# EAGLE schematic tides2_v40 (EAGLE 5.09)

## Sheet 1 of 5
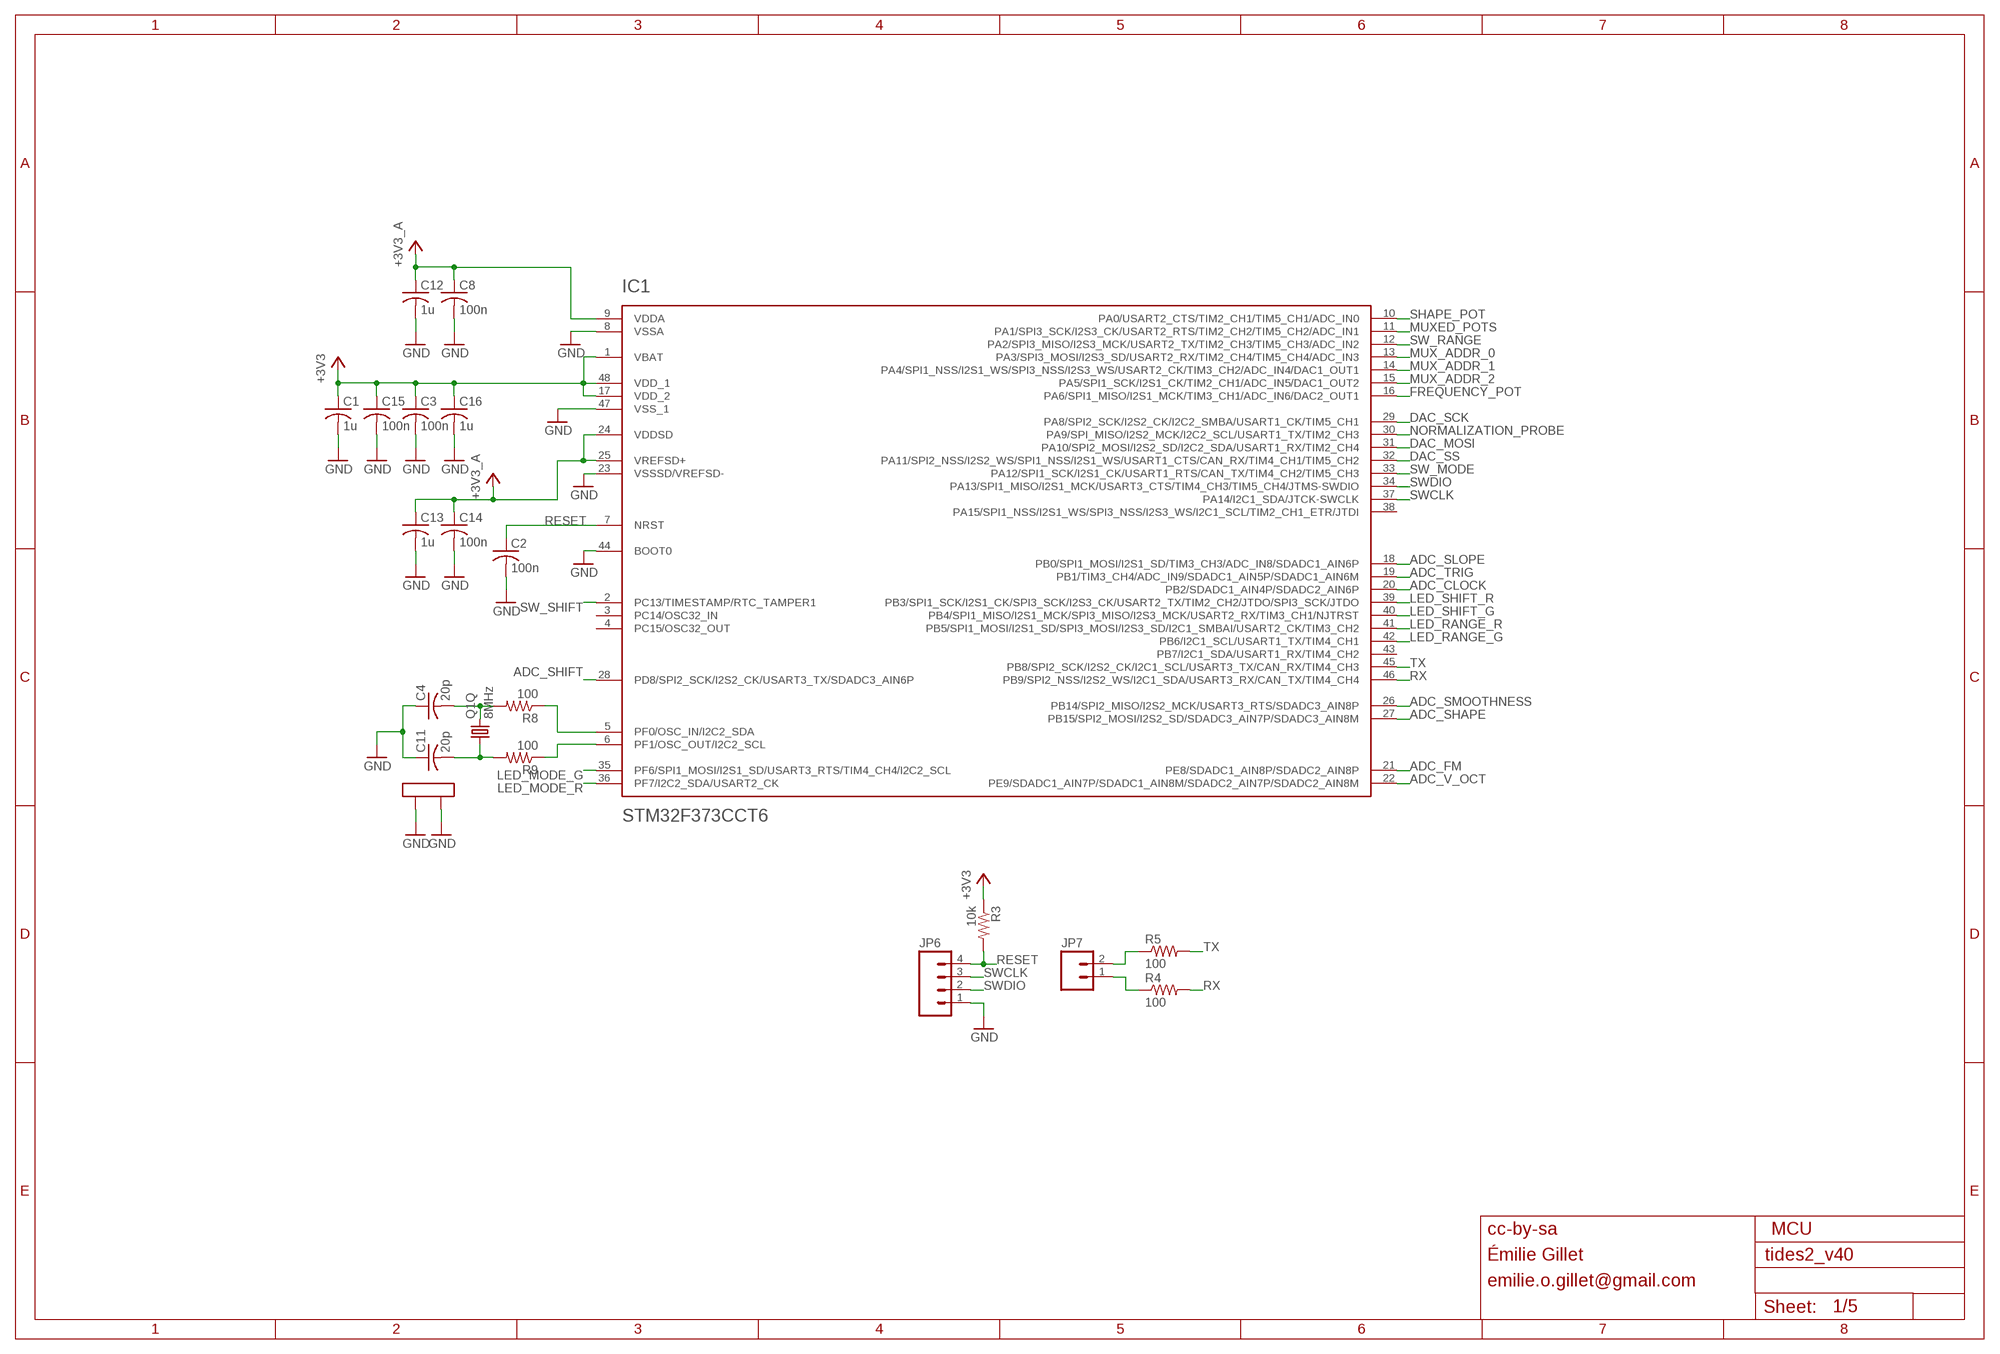
[diagram p0: schematic, sheet 1]

### Parts
C1  1u  C-USC0402  [C0402]
C2  100n  C-USC0402  [C0402]
C3  100n  C-USC0402  [C0402]
C4  20p  C-USC0402  [C0402]
C8  100n  C-USC0402  [C0402]
C11  20p  C-USC0402  [C0402]
C12  1u  C-USC0402  [C0402]
C13  1u  C-USC0402  [C0402]
C14  100n  C-USC0402  [C0402]
C15  100n  C-USC0402  [C0402]
C16  1u  C-USC0402  [C0402]
IC1  STM32F373CCT6  STM32F373C  [LQFP48]
JP6  M04PTH  [1X04]
JP7  M02PTH  [1X02]
Q1  8MHz  CRYSTAL  [CTS406]
R3  10k  R-US_R0402  [R0402]
R4  100  R-US_R0402  [R0402]
R5  100  R-US_R0402  [R0402]
R8  100  R-US_R0402  [R0402]
R9  100  R-US_R0402  [R0402]

### Nets
+3V3: C1.1 C3.1 C15.1 C16.1 IC1.1(VBAT) IC1.17(VDD_2) IC1.48(VDD_1) R3.1 ; also sheet 4,5
+3V3_A: C8.1 C12.1 C13.1 C14.1 IC1.9(VDDA) IC1.24(VDDSD) IC1.25(VREFSD+) ; also sheet 2,3,4,5
ADC_CLOCK: IC1.20(PB2/SDADC1_AIN4P/SDADC2_AIN6P) ; also sheet 3
ADC_FM: IC1.21(PE8/SDADC1_AIN8P/SDADC2_AIN8P) ; also sheet 3
ADC_SHAPE: IC1.27(PB15/SPI2_MOSI/I2S2_SD/SDADC3_AIN7P/SDADC3_AIN8M) ; also sheet 3
ADC_SHIFT: IC1.28(PD8/SPI2_SCK/I2S2_CK/USART3_TX/SDADC3_AIN6P) ; also sheet 3
ADC_SLOPE: IC1.18(PB0/SPI1_MOSI/I2S1_SD/TIM3_CH3/ADC_IN8/SDADC1_AIN6P) ; also sheet 3
ADC_SMOOTHNESS: IC1.26(PB14/SPI2_MISO/I2S2_MCK/USART3_RTS/SDADC3_AIN8P) ; also sheet 3
ADC_TRIG: IC1.19(PB1/TIM3_CH4/ADC_IN9/SDADC1_AIN5P/SDADC1_AIN6M) ; also sheet 3
ADC_V_OCT: IC1.22(PE9/SDADC1_AIN7P/SDADC1_AIN8M/SDADC2_AIN7P/SDADC2_AIN8M) ; also sheet 3
DAC_MOSI: IC1.31(PA10/SPI2_MOSI/I2S2_SD/I2C2_SDA/USART1_RX/TIM2_CH4) ; also sheet 4
DAC_SCK: IC1.29(PA8/SPI2_SCK/I2S2_CK/I2C2_SMBA/USART1_CK/TIM5_CH1) ; also sheet 4
DAC_SS: IC1.32(PA11/SPI2_NSS/I2S2_WS/SPI1_NSS/I2S1_WS/USART1_CTS/CAN_RX/TIM4_CH1/TIM5_CH2) ; also sheet 4
FREQUENCY_POT: IC1.16(PA6/SPI1_MISO/I2S1_MCK/TIM3_CH1/ADC_IN6/DAC2_OUT1) ; also sheet 2
GND: C1.2 C2.2 C3.2 C4.1 C8.2 C11.1 C12.2 C13.2 C14.2 C15.2 C16.2 IC1.8(VSSA) IC1.23(VSSSD/VREFSD-) IC1.44(BOOT0) IC1.47(VSS_1) JP6.1 Q1.2(LID1) Q1.4(LID2) ; also sheet 2,3,4,5
LED_MODE_G: IC1.35(PF6/SPI1_MOSI/I2S1_SD/USART3_RTS/TIM4_CH4/I2C2_SCL) ; also sheet 2
LED_MODE_R: IC1.36(PF7/I2C2_SDA/USART2_CK) ; also sheet 2
LED_RANGE_G: IC1.42(PB6/I2C1_SCL/USART1_TX/TIM4_CH1) ; also sheet 2
LED_RANGE_R: IC1.41(PB5/SPI1_MOSI/I2S1_SD/SPI3_MOSI/I2S3_SD/I2C1_SMBAI/USART2_CK/TIM3_CH2) ; also sheet 2
LED_SHIFT_G: IC1.40(PB4/SPI1_MISO/I2S1_MCK/SPI3_MISO/I2S3_MCK/USART2_RX/TIM3_CH1/NJTRST) ; also sheet 2
LED_SHIFT_R: IC1.39(PB3/SPI1_SCK/I2S1_CK/SPI3_SCK/I2S3_CK/USART2_TX/TIM2_CH2/JTDO/SPI3_SCK/JTDO) ; also sheet 2
MUX_ADDR_0: IC1.13(PA3/SPI3_MOSI/I2S3_SD/USART2_RX/TIM2_CH4/TIM5_CH4/ADC_IN3) ; also sheet 2
MUX_ADDR_1: IC1.14(PA4/SPI1_NSS/I2S1_WS/SPI3_NSS/I2S3_WS/USART2_CK/TIM3_CH2/ADC_IN4/DAC1_OUT1) ; also sheet 2
MUX_ADDR_2: IC1.15(PA5/SPI1_SCK/I2S1_CK/TIM2_CH1/ADC_IN5/DAC1_OUT2) ; also sheet 2
MUXED_POTS: IC1.11(PA1/SPI3_SCK/I2S3_CK/USART2_RTS/TIM2_CH2/TIM5_CH2/ADC_IN1) ; also sheet 2
N$7: IC1.5(PF0/OSC_IN/I2C2_SDA) R8.1
N$8: IC1.6(PF1/OSC_OUT/I2C2_SCL) R9.1
N$29: C4.2 Q1.3 R8.2
N$33: JP7.2 R5.1
N$35: C11.2 Q1.1 R9.2
N$51: JP7.1 R4.1
NORMALIZATION_PROBE: IC1.30(PA9/SPI_MISO/I2S2_MCK/I2C2_SCL/USART1_TX/TIM2_CH3) ; also sheet 3
RESET: C2.1 IC1.7(NRST) JP6.4 R3.2
RX: IC1.46(PB9/SPI2_NSS/I2S2_WS/I2C1_SDA/USART3_RX/CAN_TX/TIM4_CH4) R4.2
SHAPE_POT: IC1.10(PA0/USART2_CTS/TIM2_CH1/TIM5_CH1/ADC_IN0) ; also sheet 2
SW_MODE: IC1.33(PA12/SPI1_SCK/I2S1_CK/USART1_RTS/CAN_TX/TIM4_CH2/TIM5_CH3) ; also sheet 2
SW_RANGE: IC1.12(PA2/SPI3_MISO/I2S3_MCK/USART2_TX/TIM2_CH3/TIM5_CH3/ADC_IN2) ; also sheet 2
SW_SHIFT: IC1.2(PC13/TIMESTAMP/RTC_TAMPER1) ; also sheet 2
SWCLK: IC1.37(PA14/I2C1_SDA/JTCK-SWCLK) JP6.3
SWDIO: IC1.34(PA13/SPI1_MISO/I2S1_MCK/USART3_CTS/TIM4_CH3/TIM5_CH4/JTMS-SWDIO) JP6.2
TX: IC1.45(PB8/SPI2_SCK/I2S2_CK/I2C1_SCL/USART3_TX/CAN_RX/TIM4_CH3) R5.2
Unconnected: IC1.3(PC14/OSC32_IN) IC1.4(PC15/OSC32_OUT) IC1.38(PA15/SPI1_NSS/I2S1_WS/SPI3_NSS/I2S3_WS/I2C1_SCL/TIM2_CH1_ETR/JTDI) IC1.43(PB7/I2C1_SDA/USART1_RX/TIM4_CH2)

### Notes on the sheet
- cc-by-sa | MCU
- Émilie Gillet
- emilie.o.gillet@gmail.com

## Sheet 2 of 5
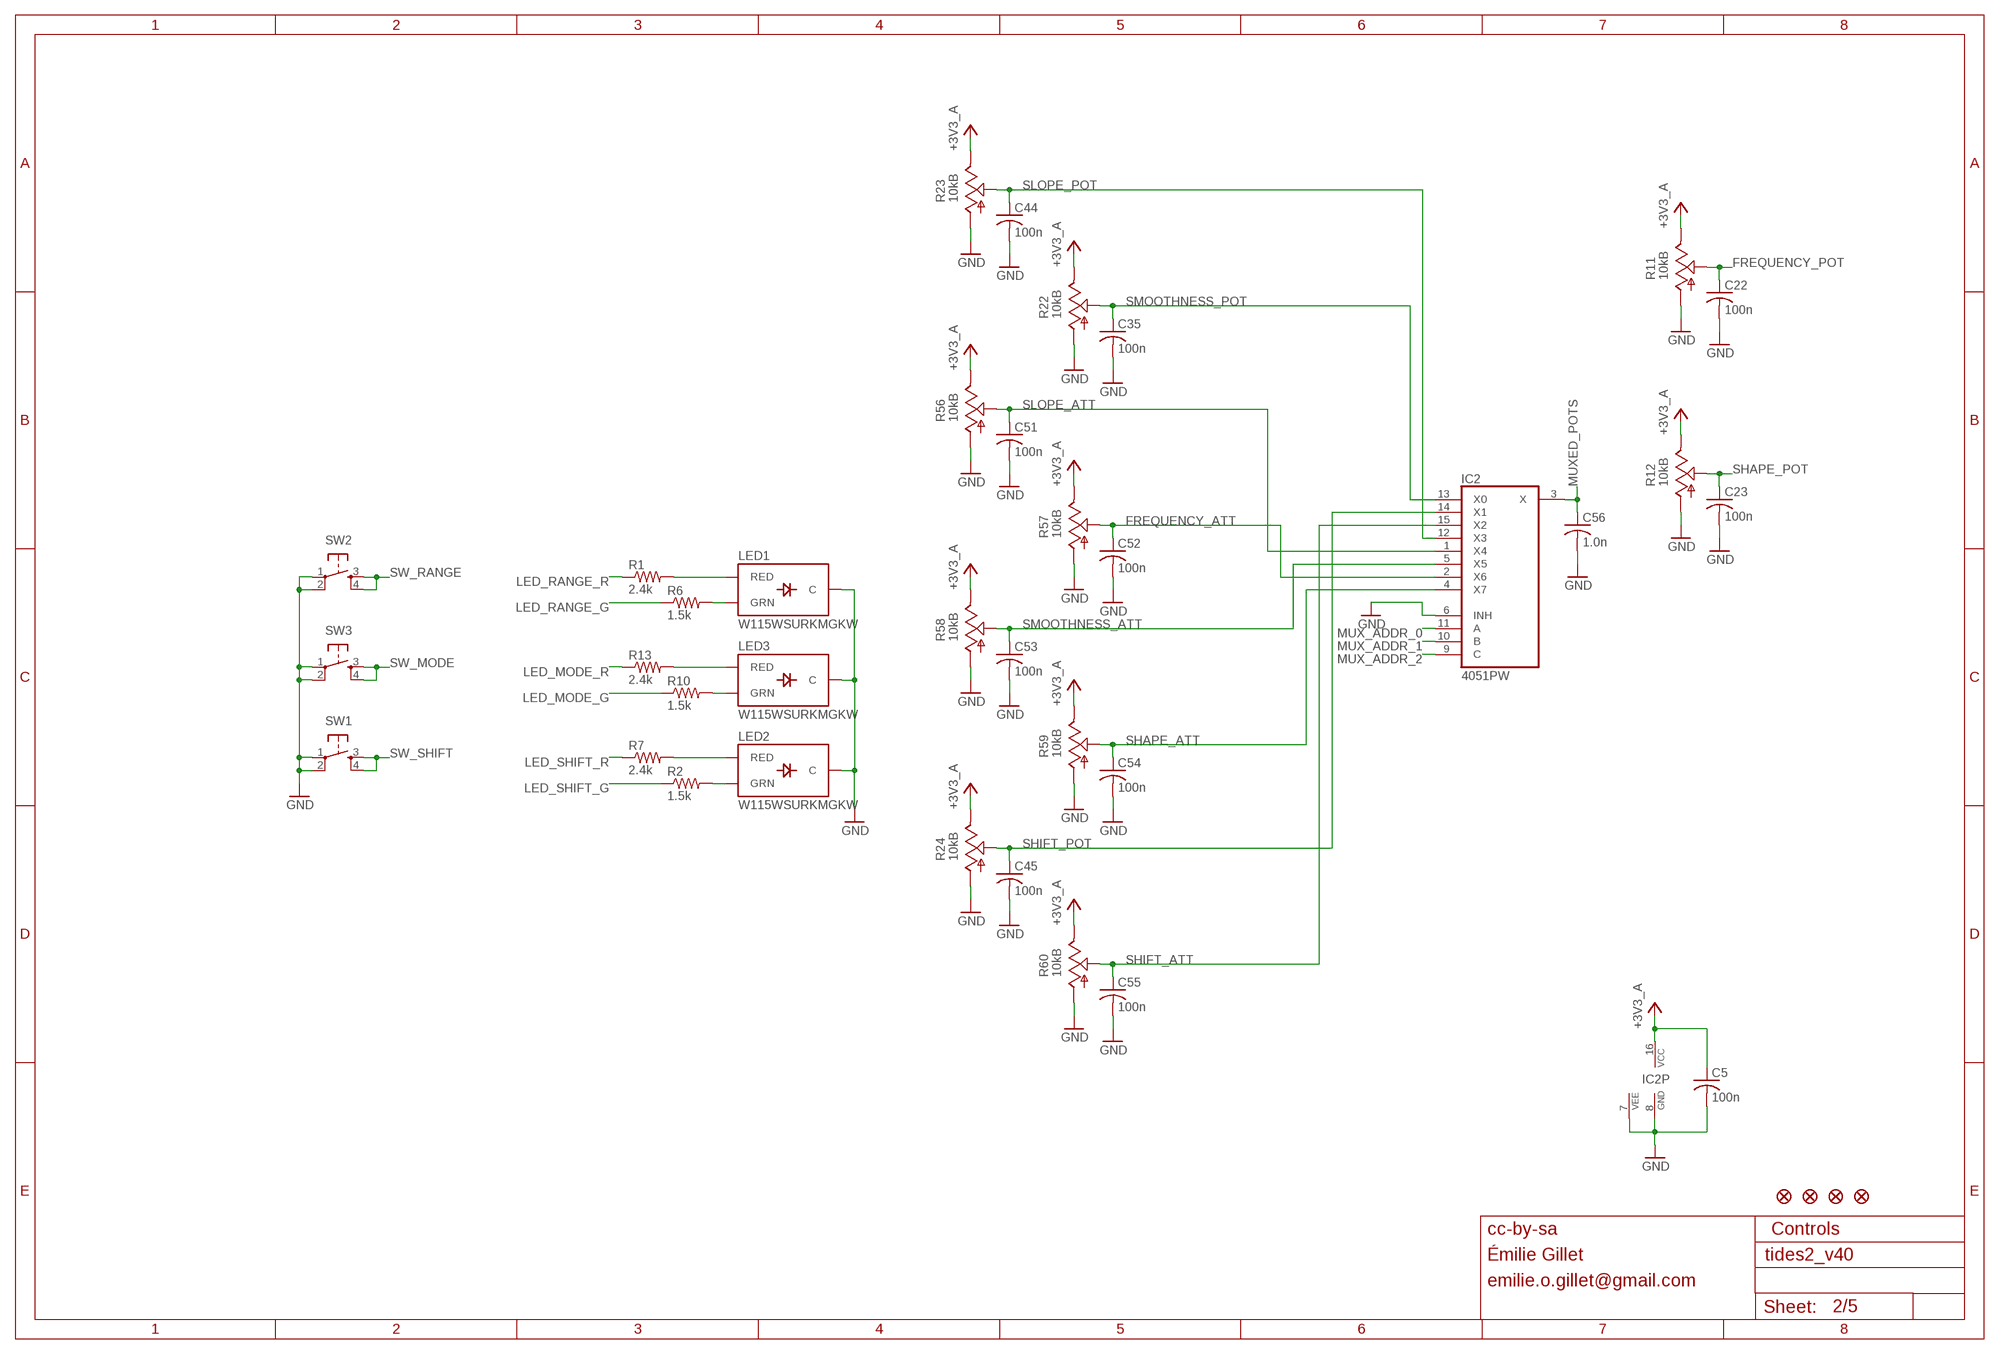
[diagram p1: schematic, sheet 2]

### Parts
C5  100n  C-USC0402  [C0402]
C22  100n  C-USC0402  [C0402]
C23  100n  C-USC0402  [C0402]
C35  100n  C-USC0402  [C0402]
C44  100n  C-USC0402  [C0402]
C45  100n  C-USC0402  [C0402]
C51  100n  C-USC0402  [C0402]
C52  100n  C-USC0402  [C0402]
C53  100n  C-USC0402  [C0402]
C54  100n  C-USC0402  [C0402]
C55  100n  C-USC0402  [C0402]
C56  1.0n  C-USC0402  [C0402]
IC2  4051PW  [TSSOP16_065]
JP1  FIDUCIAL1X2  [FIDUCIAL-1X2]
JP2  FIDUCIAL1X2  [FIDUCIAL-1X2]
JP3  FIDUCIAL1X2  [FIDUCIAL-1X2]
JP4  FIDUCIAL1X2  [FIDUCIAL-1X2]
LED1  W115WSURKMGKW  LED-BICOLOR-THROUGHHOLE2.54  [LED-BICOLOR-THROUGHHOLE-2.54]
LED2  W115WSURKMGKW  LED-BICOLOR-THROUGHHOLE2.54  [LED-BICOLOR-THROUGHHOLE-2.54]
LED3  W115WSURKMGKW  LED-BICOLOR-THROUGHHOLE2.54  [LED-BICOLOR-THROUGHHOLE-2.54]
R1  2.4k  R-US_R0402  [R0402]
R2  1.5k  R-US_R0402  [R0402]
R6  1.5k  R-US_R0402  [R0402]
R7  2.4k  R-US_R0402  [R0402]
R10  1.5k  R-US_R0402  [R0402]
R11  10kB  POT_USVERTICAL_PS  [ALPS_POT_VERTICAL_PS]
R12  10kB  POT_USVERTICAL_PS  [ALPS_POT_VERTICAL_PS]
R13  2.4k  R-US_R0402  [R0402]
R22  10kB  POT_USVERTICAL_PS  [ALPS_POT_VERTICAL_PS]
R23  10kB  POT_USVERTICAL_PS  [ALPS_POT_VERTICAL_PS]
R24  10kB  POT_USVERTICAL_PS  [ALPS_POT_VERTICAL_PS]
R56  10kB  POT_USVERTICAL  [ALPS_POT_VERTICAL]
R57  10kB  POT_USVERTICAL  [ALPS_POT_VERTICAL]
R58  10kB  POT_USVERTICAL  [ALPS_POT_VERTICAL]
R59  10kB  POT_USVERTICAL  [ALPS_POT_VERTICAL]
R60  10kB  POT_USVERTICAL  [ALPS_POT_VERTICAL]
SW1  TAC_SWITCHPTH  [TACTILE-PTH]
SW2  TAC_SWITCHPTH  [TACTILE-PTH]
SW3  TAC_SWITCHPTH  [TACTILE-PTH]

### Nets
+3V3_A: C5.1 IC2.16(VCC) R11.P$1(E) R12.P$1(E) R22.P$1(E) R23.P$1(E) R24.P$1(E) R56.P$1(E) R57.P$1(E) R58.P$1(E) R59.P$1(E) R60.P$1(E) ; also sheet 1,3,4,5
FREQUENCY_ATT: C52.1 IC2.2(X6) R57.P$2(S)
FREQUENCY_POT: C22.1 R11.P$2(S) ; also sheet 1
GND: C5.2 C22.2 C23.2 C35.2 C44.2 C45.2 C51.2 C52.2 C53.2 C54.2 C55.2 C56.2 IC2.6(INH) IC2.7(VEE) IC2.8(GND) LED1.2(C) LED2.2(C) LED3.2(C) R11.P$3(A) R12.P$3(A) R22.P$3(A) R23.P$3(A) R24.P$3(A) R56.P$3(A) R57.P$3(A) R58.P$3(A) R59.P$3(A) R60.P$3(A) SW1.1 SW1.2 SW2.1 SW2.2 SW3.1 SW3.2 ; also sheet 1,3,4,5
LED_MODE_G: R10.1 ; also sheet 1
LED_MODE_R: R13.1 ; also sheet 1
LED_RANGE_G: R6.1 ; also sheet 1
LED_RANGE_R: R1.1 ; also sheet 1
LED_SHIFT_G: R2.1 ; also sheet 1
LED_SHIFT_R: R7.1 ; also sheet 1
MUX_ADDR_0: IC2.11(A) ; also sheet 1
MUX_ADDR_1: IC2.10(B) ; also sheet 1
MUX_ADDR_2: IC2.9(C) ; also sheet 1
MUXED_POTS: C56.1 IC2.3(X) ; also sheet 1
N$16: LED1.3(RED) R1.2
N$18: LED3.3(RED) R13.2
N$20: LED3.1(GRN) R10.2
N$21: LED2.3(RED) R7.2
N$22: LED1.1(GRN) R6.2
N$23: LED2.1(GRN) R2.2
SHAPE_ATT: C54.1 IC2.4(X7) R59.P$2(S)
SHAPE_POT: C23.1 R12.P$2(S) ; also sheet 1
SHIFT_ATT: C55.1 IC2.15(X2) R60.P$2(S)
SHIFT_POT: C45.1 IC2.14(X1) R24.P$2(S)
SLOPE_ATT: C51.1 IC2.1(X4) R56.P$2(S)
SLOPE_POT: C44.1 IC2.12(X3) R23.P$2(S)
SMOOTHNESS_ATT: C53.1 IC2.5(X5) R58.P$2(S)
SMOOTHNESS_POT: C35.1 IC2.13(X0) R22.P$2(S)
SW_MODE: SW3.3 SW3.4 ; also sheet 1
SW_RANGE: SW2.3 SW2.4 ; also sheet 1
SW_SHIFT: SW1.3 SW1.4 ; also sheet 1

### Notes on the sheet
- cc-by-sa | Controls
- Émilie Gillet
- emilie.o.gillet@gmail.com

## Sheet 3 of 5
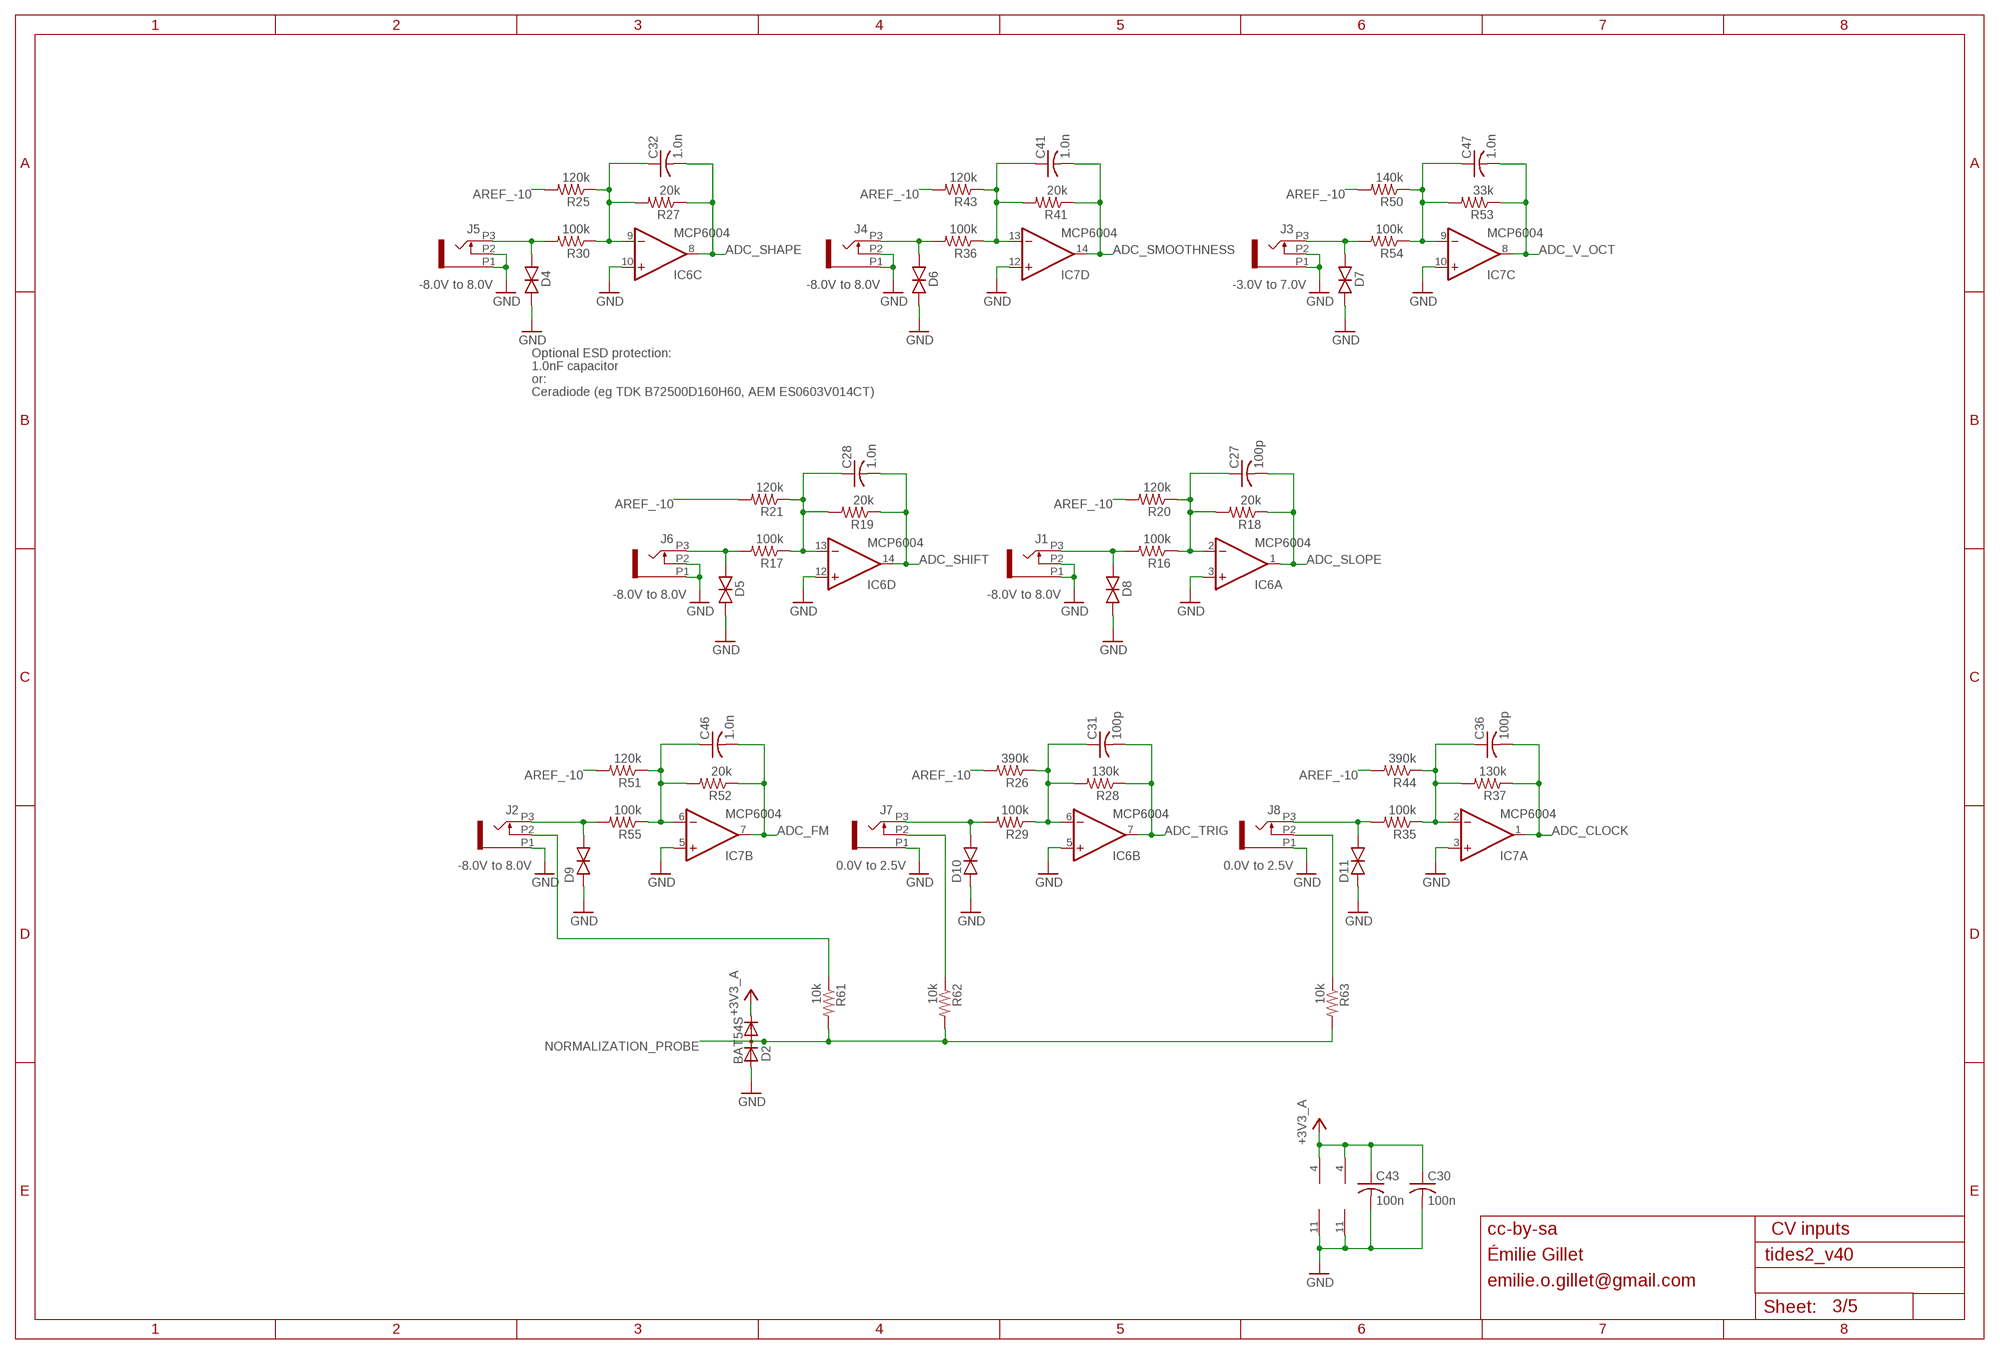
[diagram p2: schematic, sheet 3]

### Parts
C27  100p  C-USC0402  [C0402]
C28  1.0n  C-USC0402  [C0402]
C30  100n  C-USC0402  [C0402]
C31  100p  C-USC0402  [C0402]
C32  1.0n  C-USC0402  [C0402]
C36  100p  C-USC0402  [C0402]
C41  1.0n  C-USC0402  [C0402]
C43  100n  C-USC0402  [C0402]
C46  1.0n  C-USC0402  [C0402]
C47  1.0n  C-USC0402  [C0402]
D2  BAT54S  DIODE_2CACA-SOT23  [SOT23]
D4  TVS  [0603]
D5  TVS  [0603]
D6  TVS  [0603]
D7  TVS  [0603]
D8  TVS  [0603]
D9  TVS  [0603]
D10  TVS  [0603]
D11  TVS  [0603]
IC6  MCP6004  TL074PW  [TSSOP14_065]
IC7  MCP6004  TL074PW  [TSSOP14_065]
J1  PJ301_THONKICONN6  [WQP_PJ_301M6]
J2  PJ301_THONKICONN6  [WQP_PJ_301M6]
J3  PJ301_THONKICONN6  [WQP_PJ_301M6]
J4  PJ301_THONKICONN6  [WQP_PJ_301M6]
J5  PJ301_THONKICONN6  [WQP_PJ_301M6]
J6  PJ301_THONKICONN6  [WQP_PJ_301M6]
J7  PJ301_THONKICONN6  [WQP_PJ_301M6]
J8  PJ301_THONKICONN6  [WQP_PJ_301M6]
R16  100k  R-US_R0402  [R0402]
R17  100k  R-US_R0402  [R0402]
R18  20k  R-US_R0402  [R0402]
R19  20k  R-US_R0402  [R0402]
R20  120k  R-US_R0402  [R0402]
R21  120k  R-US_R0402  [R0402]
R25  120k  R-US_R0402  [R0402]
R26  390k  R-US_R0402  [R0402]
R27  20k  R-US_R0402  [R0402]
R28  130k  R-US_R0402  [R0402]
R29  100k  R-US_R0402  [R0402]
R30  100k  R-US_R0402  [R0402]
R35  100k  R-US_R0402  [R0402]
R36  100k  R-US_R0402  [R0402]
R37  130k  R-US_R0402  [R0402]
R41  20k  R-US_R0402  [R0402]
R43  120k  R-US_R0402  [R0402]
R44  390k  R-US_R0402  [R0402]
R50  140k  R-US_R0402  [R0402]
R51  120k  R-US_R0402  [R0402]
R52  20k  R-US_R0402  [R0402]
R53  33k  R-US_R0402  [R0402]
R54  100k  R-US_R0402  [R0402]
R55  100k  R-US_R0402  [R0402]
R61  10k  R-US_R0402  [R0402]
R62  10k  R-US_R0402  [R0402]
R63  10k  R-US_R0402  [R0402]

### Nets
+3V3_A: C30.1 C43.1 D2.2(C) IC6.4(P:V+) IC7.4(P:V+) ; also sheet 1,2,4,5
ADC_CLOCK: C36.2 IC7.1(A:OUT) R37.1 ; also sheet 1
ADC_FM: C46.2 IC7.7(B:OUT) R52.1 ; also sheet 1
ADC_SHAPE: C32.2 IC6.8(C:OUT) R27.1 ; also sheet 1
ADC_SHIFT: C28.2 IC6.14(D:OUT) R19.1 ; also sheet 1
ADC_SLOPE: C27.2 IC6.1(A:OUT) R18.1 ; also sheet 1
ADC_SMOOTHNESS: C41.2 IC7.14(D:OUT) R41.1 ; also sheet 1
ADC_TRIG: C31.2 IC6.7(B:OUT) R28.1 ; also sheet 1
ADC_V_OCT: C47.2 IC7.8(C:OUT) R53.1 ; also sheet 1
AREF_-10: R20.2 R21.2 R25.2 R26.2 R43.2 R44.2 R50.2 R51.2 ; also sheet 5
CLOCK_IN: D11.2(C) J8.P3 R35.2
FM_IN: D9.2(C) J2.P3 R55.2
GND: C30.2 C43.2 D2.1(A) D4.1(A) D5.1(A) D6.1(A) D7.1(A) D8.1(A) D9.1(A) D10.1(A) D11.1(A) IC6.3(A:+IN) IC6.5(B:+IN) IC6.10(C:+IN) IC6.11(P:V-) IC6.12(D:+IN) IC7.3(A:+IN) IC7.5(B:+IN) IC7.10(C:+IN) IC7.11(P:V-) IC7.12(D:+IN) J1.P1 J1.P2 J2.P1 J3.P1 J3.P2 J4.P1 J4.P2 J5.P1 J5.P2 J6.P1 J6.P2 J7.P1 J8.P1 ; also sheet 1,2,4,5
N$2: J7.P2 R62.1
N$3: J8.P2 R63.1
N$4: C27.1 IC6.2(A:-IN) R16.1 R18.2 R20.1
N$26: J2.P2 R61.1
N$28: C28.1 IC6.13(D:-IN) R17.1 R19.2 R21.1
N$30: C47.1 IC7.9(C:-IN) R50.1 R53.2 R54.1
N$32: C46.1 IC7.6(B:-IN) R51.1 R52.2 R55.1
N$34: C31.1 IC6.6(B:-IN) R26.1 R28.2 R29.1
N$37: C32.1 IC6.9(C:-IN) R25.1 R27.2 R30.1
N$39: C36.1 IC7.2(A:-IN) R35.1 R37.2 R44.1
N$41: C41.1 IC7.13(D:-IN) R36.1 R41.2 R43.1
NORMALIZATION_PROBE: D2.3(AC) R61.2 R62.2 R63.2 ; also sheet 1
SHAPE_IN: D4.2(C) J5.P3 R30.2
SHIFT_IN: D5.2(C) J6.P3 R17.2
SLOPE_IN: D8.2(C) J1.P3 R16.2
SMOOTHNESS_IN: D6.2(C) J4.P3 R36.2
TRIG_IN: D10.2(C) J7.P3 R29.2
V_OCT_IN: D7.2(C) J3.P3 R54.2

### Notes on the sheet
- -8.0V to 8.0V | -8.0V to 8.0V | -3.0V to 7.0V
- Optional ESD protection:
- 1.0nF capacitor
- or:
- Ceradiode (eg TDK B72500D160H60, AEM ES0603V014CT)
- -8.0V to 8.0V | -8.0V to 8.0V
- -8.0V to 8.0V | 0.0V to 2.5V | 0.0V to 2.5V
- cc-by-sa | CV inputs
- Émilie Gillet
- emilie.o.gillet@gmail.com

## Sheet 4 of 5
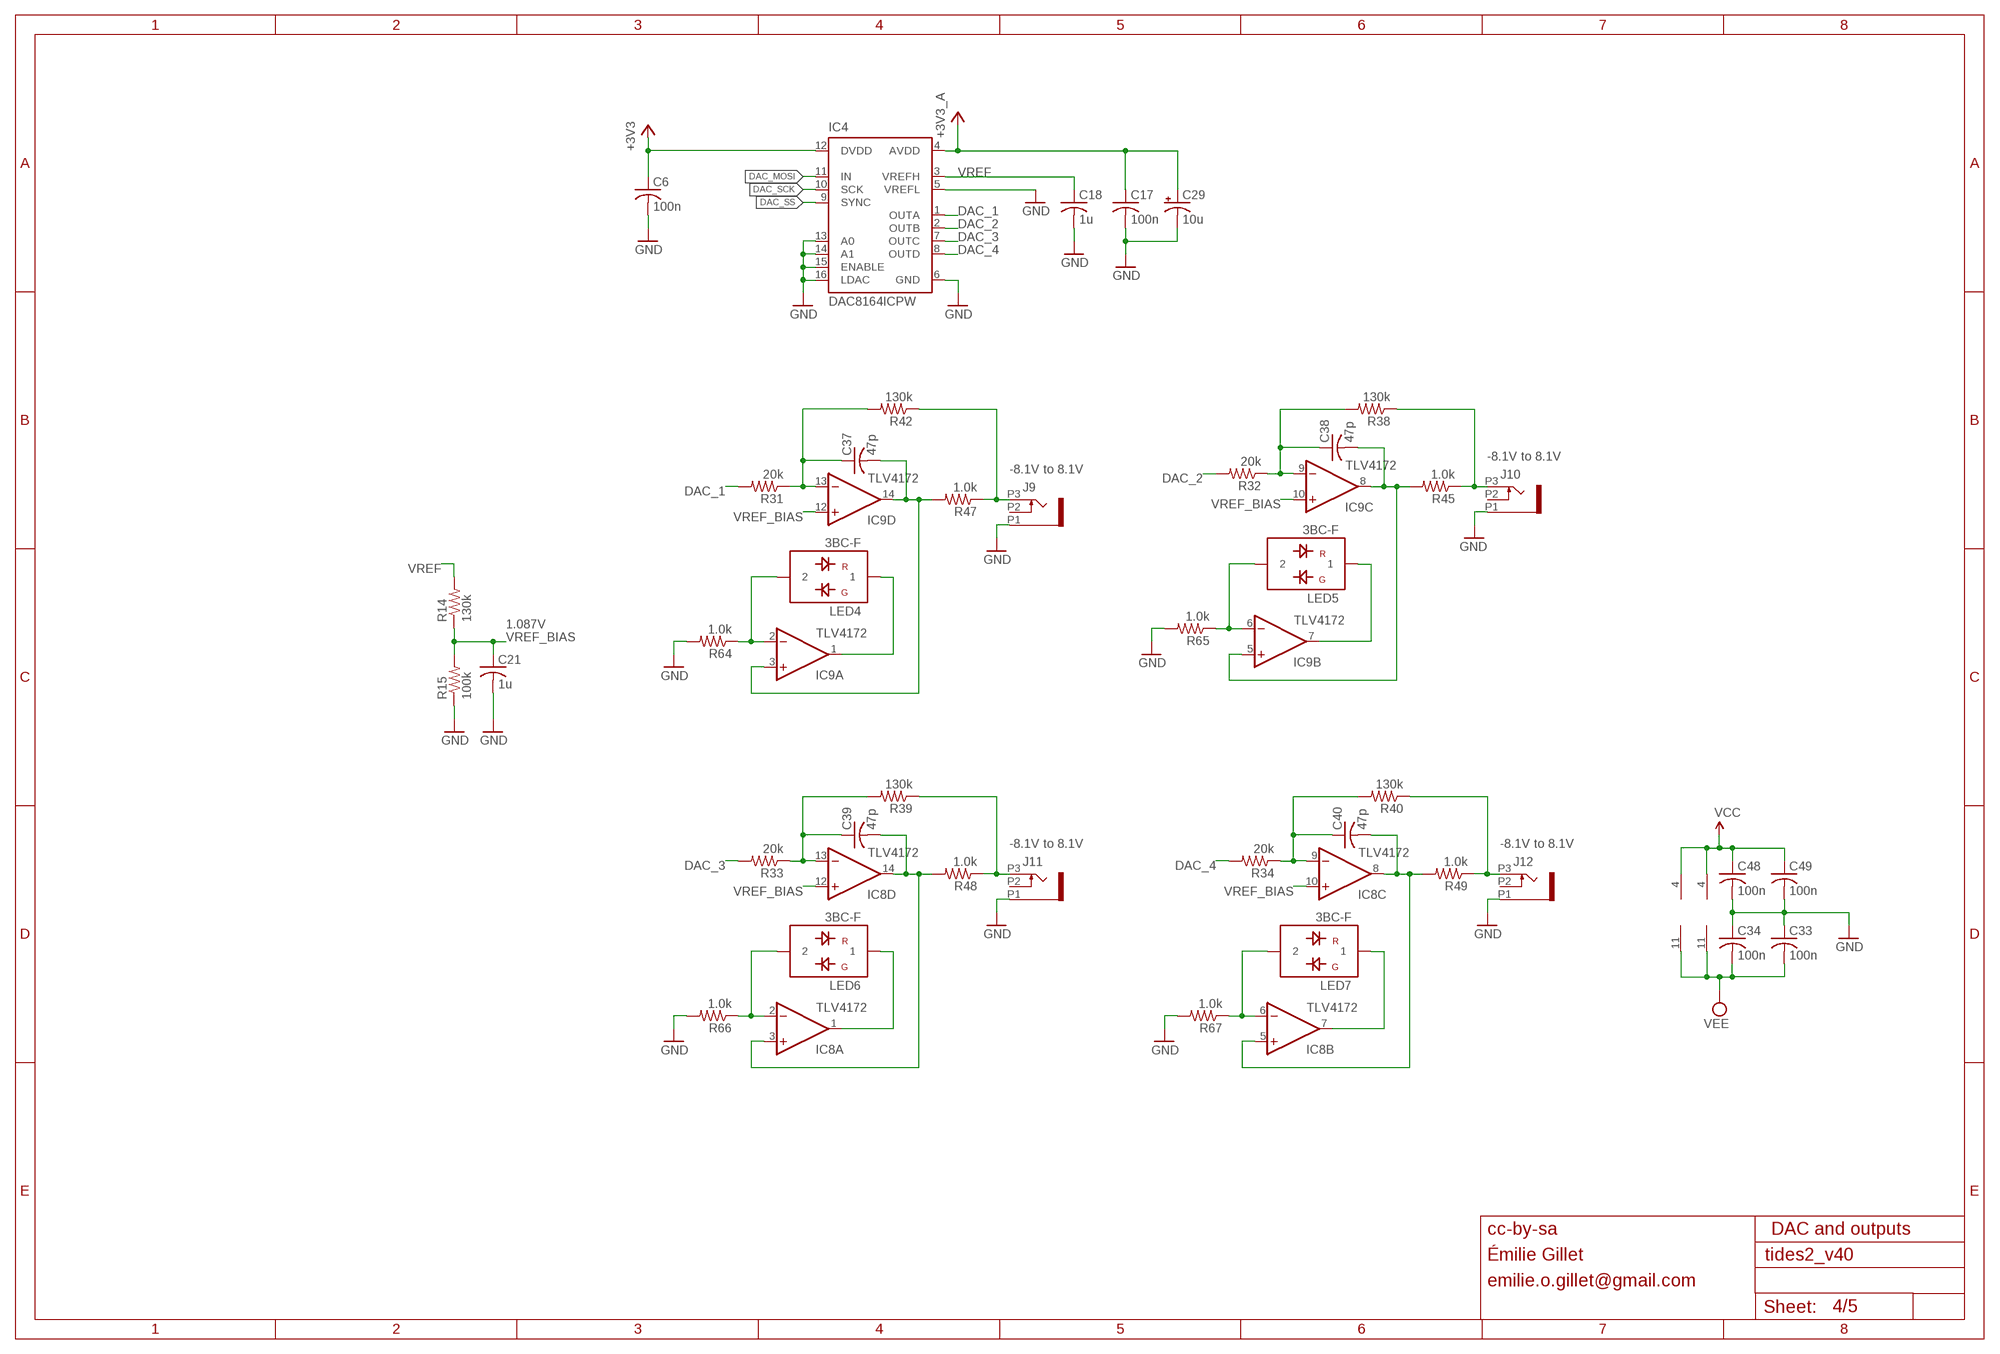
[diagram p3: schematic, sheet 4]

### Parts
C6  100n  C-USC0402  [C0402]
C17  100n  C-USC0402  [C0402]
C18  1u  C-USC0402  [C0402]
C21  1u  C-USC0402  [C0402]
C29  10u  CPOL-USA  [PANASONIC_A]
C33  100n  C-USC0402  [C0402]
C34  100n  C-USC0402  [C0402]
C37  47p  C-USC0402  [C0402]
C38  47p  C-USC0402  [C0402]
C39  47p  C-USC0402  [C0402]
C40  47p  C-USC0402  [C0402]
C48  100n  C-USC0402  [C0402]
C49  100n  C-USC0402  [C0402]
IC4  DAC8164ICPW  DAC8564  [SOP65P640X110-16N]
IC8  TLV4172  TL074PW  [TSSOP14_065]
IC9  TLV4172  TL074PW  [TSSOP14_065]
J9  PJ301_THONKICONN6  [WQP_PJ_301M6]
J10  PJ301_THONKICONN6  [WQP_PJ_301M6]
J11  PJ301_THONKICONN6  [WQP_PJ_301M6]
J12  PJ301_THONKICONN6  [WQP_PJ_301M6]
LED4  3BC-F  LED-BICOLOR-SHARED-THROUGHHOLE  [LED3MM]
LED5  3BC-F  LED-BICOLOR-SHARED-THROUGHHOLE  [LED3MM]
LED6  3BC-F  LED-BICOLOR-SHARED-THROUGHHOLE  [LED3MM]
LED7  3BC-F  LED-BICOLOR-SHARED-THROUGHHOLE  [LED3MM]
R14  130k  R-US_R0402  [R0402]
R15  100k  R-US_R0402  [R0402]
R31  20k  R-US_R0402  [R0402]
R32  20k  R-US_R0402  [R0402]
R33  20k  R-US_R0402  [R0402]
R34  20k  R-US_R0402  [R0402]
R38  130k  R-US_R0402  [R0402]
R39  130k  R-US_R0402  [R0402]
R40  130k  R-US_R0402  [R0402]
R42  130k  R-US_R0402  [R0402]
R45  1.0k  R-US_R0603  [R0603]
R47  1.0k  R-US_R0603  [R0603]
R48  1.0k  R-US_R0603  [R0603]
R49  1.0k  R-US_R0603  [R0603]
R64  1.0k  R-US_R0402  [R0402]
R65  1.0k  R-US_R0402  [R0402]
R66  1.0k  R-US_R0402  [R0402]
R67  1.0k  R-US_R0402  [R0402]

### Nets
+3V3: C6.1 IC4.12(DVDD) ; also sheet 1,5
+3V3_A: C17.1 C29.+ IC4.4(AVDD) ; also sheet 1,2,3,5
DAC_1: IC4.1(OUTA) R31.2
DAC_2: IC4.2(OUTB) R32.2
DAC_3: IC4.7(OUTC) R33.2
DAC_4: IC4.8(OUTD) R34.2
DAC_MOSI: IC4.11(IN) ; also sheet 1
DAC_SCK: IC4.10(SCK) ; also sheet 1
DAC_SS: IC4.9(SYNC) ; also sheet 1
GND: C6.2 C17.2 C18.2 C21.2 C29.- C33.1 C34.1 C48.2 C49.2 IC4.5(VREFL) IC4.6(GND) IC4.13(A0) IC4.14(A1) IC4.15(ENABLE) IC4.16(LDAC) J9.P1 J10.P1 J11.P1 J12.P1 R15.1 R64.2 R65.2 R66.2 R67.2 ; also sheet 1,2,3,5
N$45: C37.2 IC9.3(A:+IN) IC9.14(D:OUT) R47.2
N$49: J11.P3 R39.1 R48.1
N$53: J9.P3 R42.1 R47.1
N$54: C39.1 IC8.13(D:-IN) R33.1 R39.2
N$58: J12.P3 R40.1 R49.1
N$59: C40.1 IC8.9(C:-IN) R34.1 R40.2
N$60: C38.1 IC9.9(C:-IN) R32.1 R38.2
N$61: C37.1 IC9.13(D:-IN) R31.1 R42.2
N$63: J10.P3 R38.1 R45.1
N$67: IC9.2(A:-IN) LED4.2 R64.1
N$68: IC9.1(A:OUT) LED4.1
N$70: C38.2 IC9.5(B:+IN) IC9.8(C:OUT) R45.2
N$71: IC9.6(B:-IN) LED5.2 R65.1
N$72: IC9.7(B:OUT) LED5.1
N$73: C39.2 IC8.3(A:+IN) IC8.14(D:OUT) R48.2
N$74: IC8.2(A:-IN) LED6.2 R66.1
N$75: IC8.1(A:OUT) LED6.1
N$76: C40.2 IC8.5(B:+IN) IC8.8(C:OUT) R49.2
N$77: IC8.6(B:-IN) LED7.2 R67.1
N$78: IC8.7(B:OUT) LED7.1
VCC: C48.1 C49.1 IC8.4(P:V+) IC9.4(P:V+) ; also sheet 5
VEE: C33.2 C34.2 IC8.11(P:V-) IC9.11(P:V-) ; also sheet 5
VREF: C18.1 IC4.3(VREFH) R14.2
VREF_BIAS: C21.1 IC8.10(C:+IN) IC8.12(D:+IN) IC9.10(C:+IN) IC9.12(D:+IN) R14.1 R15.2
Unconnected: J9.P2 J10.P2 J11.P2 J12.P2

### Notes on the sheet
- -8.1V to 8.1V
- -8.1V to 8.1V
- 1.087V
- -8.1V to 8.1V | -8.1V to 8.1V
- cc-by-sa | DAC and outputs
- Émilie Gillet
- emilie.o.gillet@gmail.com

## Sheet 5 of 5
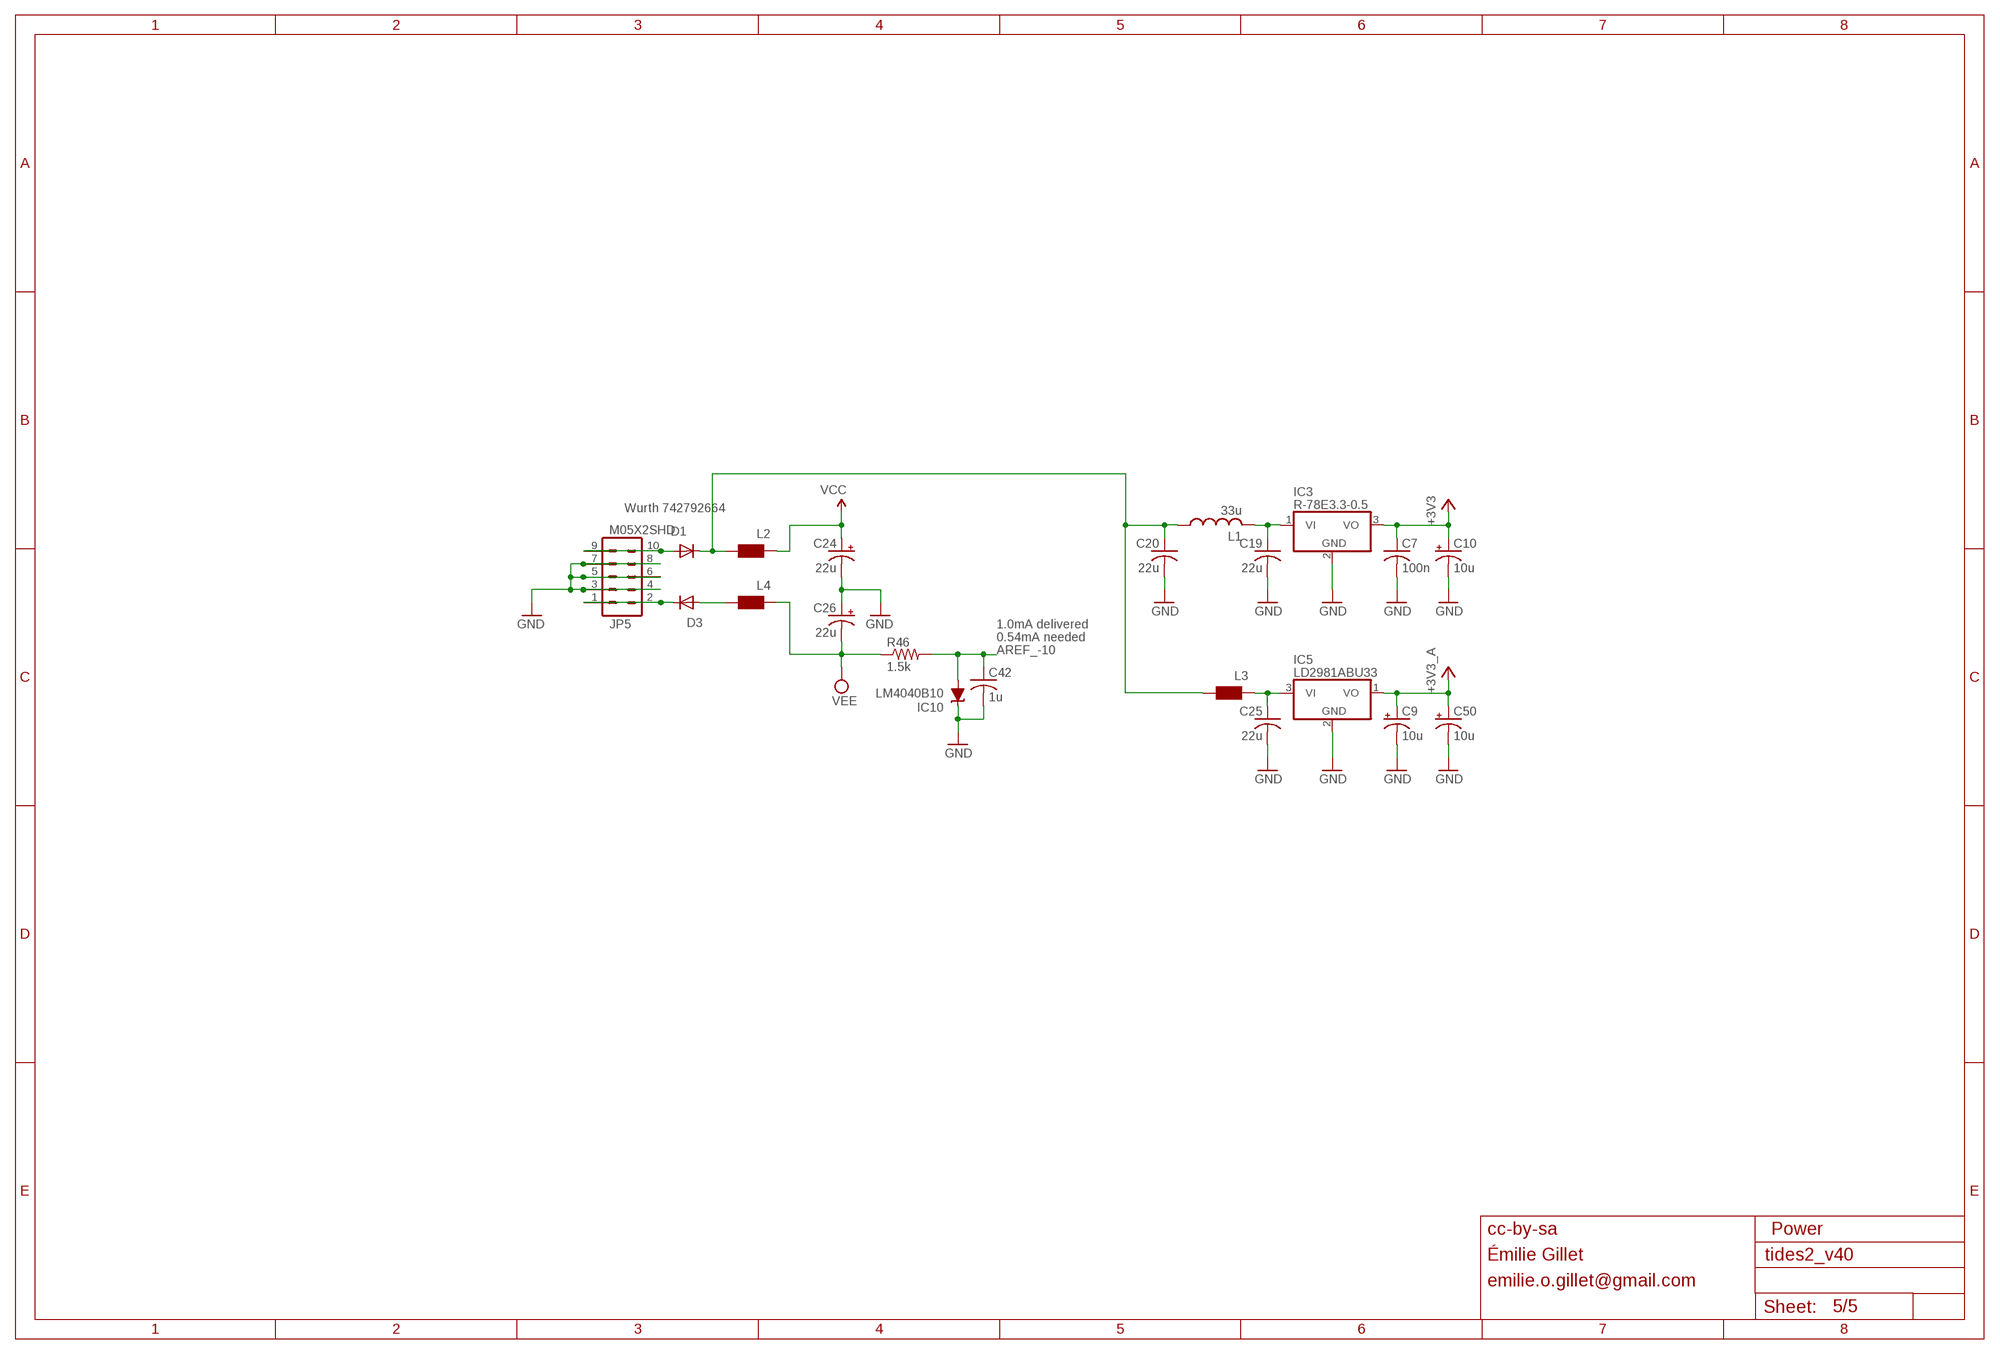
[diagram p4: schematic, sheet 5]

### Parts
C7  100n  C-USC0402  [C0402]
C9  10u  CPOL-USA  [PANASONIC_A]
C10  10u  CPOL-USA  [PANASONIC_A]
C19  22u  C-USC1206  [C1206]
C20  22u  C-USC1206  [C1206]
C24  22u  CPOL-USB  [PANASONIC_B]
C25  22u  C-USC1206  [C1206]
C26  22u  CPOL-USB  [PANASONIC_B]
C42  1u  C-USC0402  [C0402]
C50  10u  CPOL-USA  [PANASONIC_A]
D1  1N5819HW  DIODE-SOD123  [SOD123]
D3  1N5819HW  DIODE-SOD123  [SOD123]
IC3  R-78E3.3-0.5  WE173950378  [WE78]
IC5  LD2981ABU33  LD2981ABU  [SOT89]
IC10  LM4040B10  LM4041B12DBZ  [DBZ_R-PDSO-G3]
JP5  M05X2SHD  [2X5-SHROUDED]
L1  33u  L-USL2012C  [L2012C]
L2  WE-CBF_0603  [0603]
L3  WE-CBF_0603  [0603]
L4  WE-CBF_0603  [0603]
R46  1.5k  R-US_R0402  [R0402]

### Nets
+3V3: C7.1 C10.+ IC3.3(VO) ; also sheet 1,4
+3V3_A: C9.+ C50.+ IC5.1(VO) ; also sheet 1,2,3,4
AREF_-10: C42.1 IC10.2(A) R46.2 ; also sheet 3
GND: C7.2 C9.- C10.- C19.2 C20.2 C24.- C25.2 C26.+ C42.2 C50.- IC3.2(GND) IC5.2(GND) IC10.1(C) JP5.3 JP5.4 JP5.5 JP5.6 JP5.7 JP5.8 ; also sheet 1,2,3,4
N$1: C19.1 IC3.1(VI) L1.2
N$38: D3.A L4.2
N$40: C20.1 D1.C L1.1 L2.2 L3.2
N$42: C25.1 IC5.3(VI) L3.1
N$56: D1.A JP5.9 JP5.10
N$64: D3.C JP5.1 JP5.2
VCC: C24.+ L2.1 ; also sheet 4
VEE: C26.- L4.1 R46.1 ; also sheet 4

### Notes on the sheet
- Wurth 742792664
- 1.0mA delivered
- 0.54mA needed
- cc-by-sa | Power
- Émilie Gillet
- emilie.o.gillet@gmail.com

## Library data of the parts
C1-C8 C11-C23 C25 C27 C28 C30-C49 C51-C56 = rcl:C-US: CAPACITOR, American symbol
C9 C10 C24 C26 C29 C50 = rcl:CPOL-US: POLARIZED CAPACITOR, American symbol
D1 D3 = diode:DIODE-: DIODE
D2 = diode:DIODE_2CACA-: 2 Diodes - Cathode-Anode|Cathode-Anode
D4-D11 = og-diodes:TVS
IC1 = og-stm32f2:STM32F373C
IC2 = og-ics:4051: 8-channel ANALOG MULTIPLEXER
IC3 = og-vreg:WE173950378
IC4 = og-dac:DAC8564
IC5 = og-vreg:LD2981
IC6-IC9 = og-linear:TL074: OP AMP
IC10 = texas:LM4041: PRECISION MICROPOWER SHUNT VOLTAGE REFERENCE Source: http://focus.ti.com/lit/ds/slcs146e/slcs146e.pdf
J1-J8 = og-pj301_variations:PJ301_THONKICONN
J9-J12 = og-pj301:PJ301_THONKICONN
JP1-JP4 = SparkFun:FIDUCIAL: Fiducial Alignment Points Various fiducial points for machine vision alignment.
JP5 = og-header:M05X2: Header 5x2 Standard 10-pin dual row 0.1" header. Commonly used with AVR-ISP. Use with Spark Fun Electronics SKU: PRT-00778
JP6 = SparkFun:M04: Header 4 Standard 4-pin 0.1" header. Use with straight break away headers (SKU : PRT-00116), right angle break away headers (PRT-00553), swiss pins (PRT-00743), machine pins (PRT-00117), and female headers (PRT-00115). Molex polarized connector foot print use with SKU : PRT-08231 with associated crimp pins and housings.
JP7 = SparkFun:M02: Header 2 Standard 2-pin 0.1" header. Use with straight break away headers (SKU : PRT-00116), right angle break away headers (PRT-00553), swiss pins (PRT-00743), machine pins (PRT-00117), and female headers (PRT-00115). Molex polarized connector foot print use with SKU : PRT-08233 with associated crimp pins and housings.
L1 = og-rcl:L-US
L2-L4 = wuerth-elektronik:WE-CBF: SMD EMI Suppression Ferrite Beads - excellent anti-EMI properties - low DCR - impedances till 3000 ohms - rated current up to 6 A
LED1-LED3 = og-leds:LED-BICOLOR-THROUGHHOLE
LED4-LED7 = og-leds:LED-BICOLOR-SHARED-THROUGHHOLE
Q1 = og-crystal:CRYSTAL: Crystal with 2 extra terminals for the metal LID (Abracon ABMM2 for example)
R1-R10 R13-R21 R25-R55 R61-R67 = rcl:R-US_: RESISTOR, American symbol
R11 R12 R22-R24 R56-R60 = og-pots:POT_US
SW1-SW3 = SparkFun:TAC_SWITCH: Momentary Switch Button commonly used for reset or general input. Spark Fun Electronics SKU : COM-00097